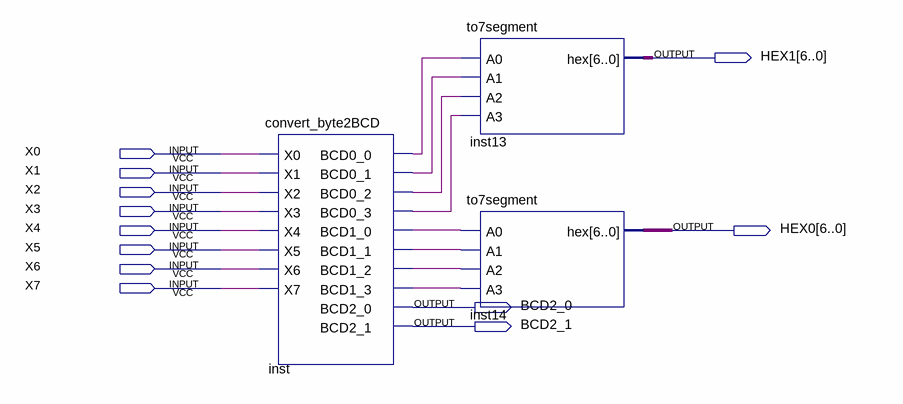
[diagram p0: schematic sheet]
// Quartus schematic MyDebug.bdf as structural Verilog: 3 symbols, 12 pins
module MyDebug (
  input  X0,
  input  X1,
  input  X2,
  input  X3,
  input  X4,
  input  X5,
  input  X6,
  input  X7,
  output [6:0] HEX1,
  output [6:0] HEX0,
  output BCD2_0,
  output BCD2_1
);

  wire inst_bcd0_0, inst_bcd0_1, inst_bcd0_2, inst_bcd0_3, inst_bcd1_0, inst_bcd1_1, inst_bcd1_2, inst_bcd1_3;

  convert_byte2BCD inst (
    .X0(X0), .X1(X1), .X2(X2), .X3(X3), .X4(X4), .X5(X5), .X6(X6), .X7(X7), .BCD0_0(inst_bcd0_0),
    .BCD0_1(inst_bcd0_1), .BCD0_2(inst_bcd0_2), .BCD0_3(inst_bcd0_3), .BCD1_0(inst_bcd1_0),
    .BCD1_1(inst_bcd1_1), .BCD1_2(inst_bcd1_2), .BCD1_3(inst_bcd1_3), .BCD2_0(BCD2_0), .BCD2_1(BCD2_1));
  to7segment inst13 (.A0(inst_bcd0_0), .A1(inst_bcd0_1), .A2(inst_bcd0_2), .A3(inst_bcd0_3), .hex(HEX1));
  to7segment inst14 (.A0(inst_bcd1_0), .A1(inst_bcd1_1), .A2(inst_bcd1_2), .A3(inst_bcd1_3), .hex(HEX0));
endmodule
